# Altium schematic sheet usb_io_v3_sch.SchDoc
size A
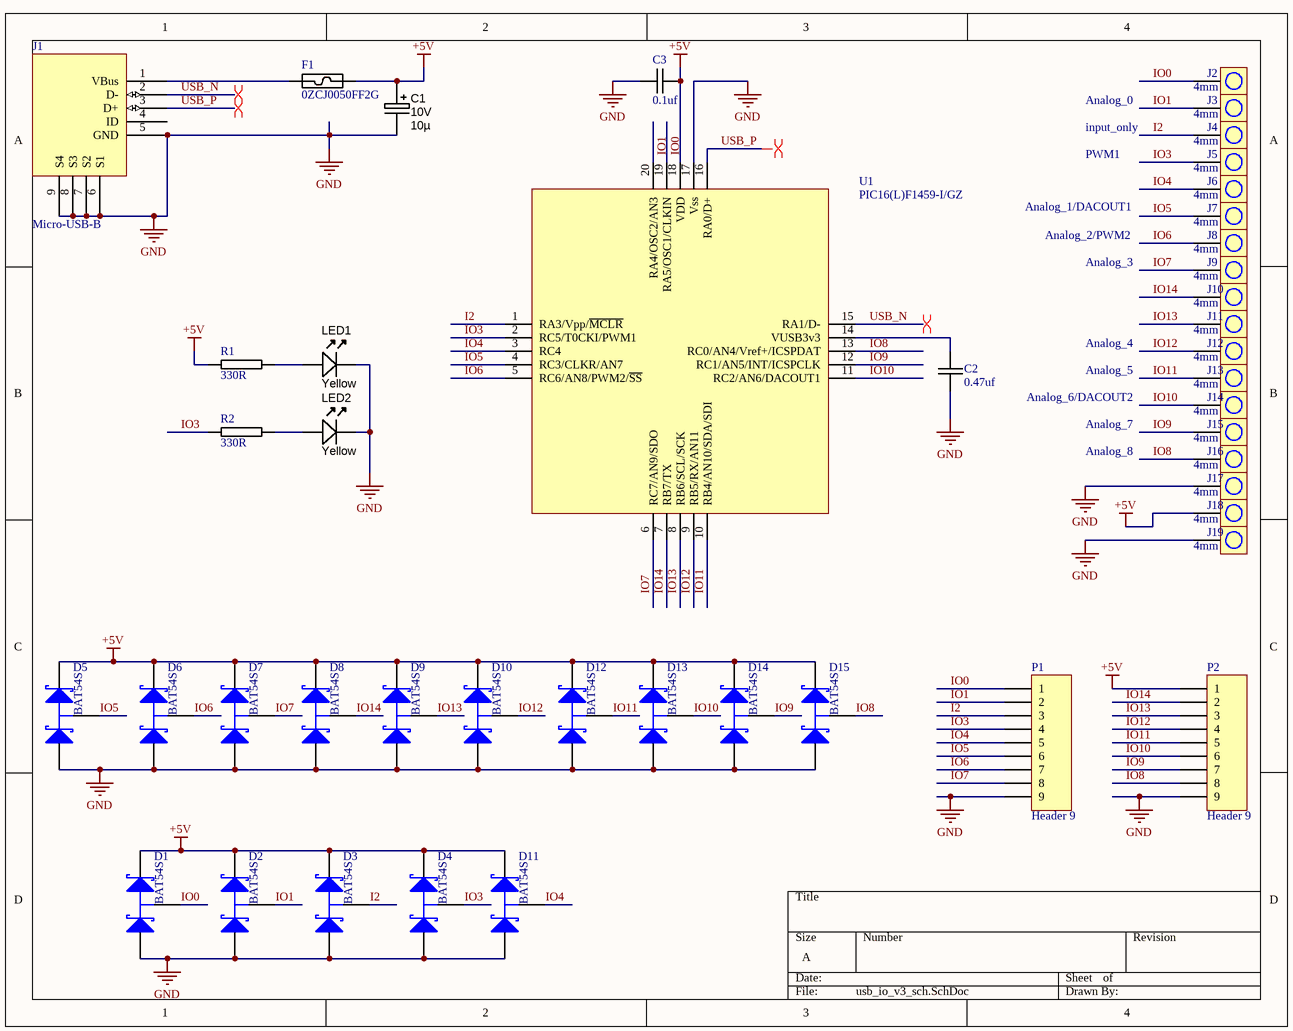
[diagram p0: usb_io_v3_sch.SchDoc]

## Parts
C1  Ratings: 10V  [CAPMP3528X210N]  (hidden comment: 10µ)
C2  0.47uf  [0603C-GENERIC]
C3  0.1uf  [0603C-GENERIC]
D1  BAT54S  [SOT23_N]
D2  BAT54S  [SOT23_N]
D3  BAT54S  [SOT23_N]
D4  BAT54S  [SOT23_N]
D5  BAT54S  [SOT23_N]
D6  BAT54S  [SOT23_N]
D7  BAT54S  [SOT23_N]
D8  BAT54S  [SOT23_N]
D9  BAT54S  [SOT23_N]
D10  BAT54S  [SOT23_N]
D11  BAT54S  [SOT23_N]
D12  BAT54S  [SOT23_N]
D13  BAT54S  [SOT23_N]
D14  BAT54S  [SOT23_N]
D15  BAT54S  [SOT23_N]
F1  0ZCJ0050FF2G  [RESC3216N]
J1  Micro-USB-B  [10118193-0001lfc]
J2  4mm  [header_4mm_drill]
J3  4mm  [header_4mm_drill]
J4  4mm  [header_4mm_drill]
J5  4mm  [header_4mm_drill]
J6  4mm  [header_4mm_drill]
J7  4mm  [header_4mm_drill]
J8  4mm  [header_4mm_drill]
J9  4mm  [header_4mm_drill]
J10  4mm  [header_4mm_drill]
J11  4mm  [header_4mm_drill]
J12  4mm  [header_4mm_drill]
J13  4mm  [header_4mm_drill]
J14  4mm  [header_4mm_drill]
J15  4mm  [header_4mm_drill]
J16  4mm  [header_4mm_drill]
J17  4mm  [header_4mm_drill]
J18  4mm  [header_4mm_drill]
J19  4mm  [header_4mm_drill]
LED1  Yellow  [LED-0603-YELLOW]
LED2  Yellow  [LED-0603-YELLOW]
P1  Header 9  [HDR1X9]
P2  Header 9  [HDR1X9]
R1  330R  [0603R-2K2]
R2  330R  [0603R-2K2]
U1  PIC16(L)F1459-I/GZ  [UQFN20_4x4]

## Nets
+5V: C1.1 C3.2 D1.2(K) D2.2(K) D3.2(K) D4.2(K) D5.2(K) D6.2(K) D7.2(K) D8.2(K) D9.2(K) D10.2(K) D11.2(K) D12.2(K) D13.2(K) D14.2(K) D15.2(K) F1.2 J18.1 P2.1 R1.2 U1.18(VDD)
GND: C1.2 C2.1 C3.1 D1.1(A) D2.1(A) D3.1(A) D4.1(A) D5.1(A) D6.1(A) D7.1(A) D8.1(A) D9.1(A) D10.1(A) D11.1(A) D12.1(A) D13.1(A) D14.1(A) D15.1(A) J1.5(GND) J1.6(S1) J1.7(S2) J1.8(S3) J1.9(S4) J17.1 J19.1 LED1.K LED2.K P1.9 P2.9 U1.17(Vss)
I2: D3.3(C) J4.1 P1.3 U1.1(RA3/Vpp/~{MCLR})
IO0: D1.3(C) J2.1 P1.1 U1.19(RA5/OSC1/CLKIN)
IO1: D2.3(C) J3.1 P1.2 U1.20(RA4/OSC2/AN3)
IO3: D4.3(C) J5.1 P1.4 R2.2 U1.2(RC5/T0CKI/PWM1)
IO4: D11.3(C) J6.1 P1.5 U1.3(RC4)
IO5: D5.3(C) J7.1 P1.6 U1.4(RC3/CLKR/AN7)
IO6: D6.3(C) J8.1 P1.7 U1.5(RC6/AN8/PWM2/~{SS})
IO7: D7.3(C) J9.1 P1.8 U1.6(RC7/AN9/SDO)
IO8: D15.3(C) J16.1 P2.8 U1.13(RC0/AN4/Vref+/ICSPDAT)
IO9: D14.3(C) J15.1 P2.7 U1.12(RC1/AN5/INT/ICSPCLK)
IO10: D13.3(C) J14.1 P2.6 U1.11(RC2/AN6/DACOUT1)
IO11: D12.3(C) J13.1 P2.5 U1.10(RB4/AN10/SDA/SDI)
IO12: D10.3(C) J12.1 P2.4 U1.9(RB5/RX/AN11)
IO13: D9.3(C) J11.1 P2.3 U1.8(RB6/SCL/SCK)
IO14: D8.3(C) J10.1 P2.2 U1.7(RB7/TX)
USB_N: J1.2(D-) U1.15(RA1/D-)
USB_P: J1.3(D+) U1.16(RA0/D+)
NetC2_2: C2.2 U1.14(VUSB3v3)
NetF1_1: F1.1 J1.1(VBus)
NetLED1_A: LED1.A R1.1
NetLED2_A: LED2.A R2.1

Not connected (* = marked no-connect by the designer): J1 4(ID)

## Layout directives
differential pair: USB_N, USB_P

## Notes on the sheet
- Analog_0
- input_only
- PWM1
- Analog_1/DACOUT1
- Analog_2/PWM2
- Analog_3
- Analog_4
- Analog_5
- Analog_6/DACOUT2
- Analog_7
- Analog_8

## Library data of the parts
C1 = CAPT_47u_1210_6V3: Capacitor SMD Tantalum 47uF 20% 6.3V 1210; Manufacturer 1: AVX Corporation; Manufacturer Part Number 1: TCJB476M006R0070; Manufacturer Size Code: B; Voltage - Rated: 6V3; ESR (Equivalent Series Resistance): 70.0 mOhm; Type: Molded; Package / Case: 1210 (3528 Metric); Tolerance: ±20%; Material: Tantalum; Supplier 1: Digi-Key; Supplier Part Number 1: 478-3139-1-ND; Operating Temperature: -55°C ~ 125°C; Size / Dimension: 0.138" L x 0.110" W (3.50mm x 2.80mm); Height - Seated (Max): 0.083" (2.10mm); ComponentLink1URL: http://www.avx.com/docs/Catalogs/tcj.pdf; ComponentLink1Description: http://www.avx.com/docs/Catalogs/tcj.pdf; Value: 10µ
C2 C3 = 0603C-10UF-6V3-X5R-MUR: CAPACITOR 0603 CERAMIC; Manufacturer: Murata Electronics North America; Manufacturer Part Number: GRM188R60J106ME47D; Reel: C24; Supplier 1: Digi-Key; Supplier Part Number 1: 490-3896-2-ND
D1-D15 = BAT54S: Schottky Barrier Double Diode; Published: 17-Sep-2003; LatestRevisionDate: 12-Dec-2006; LatestRevisionNote: IPC-7351 Footprint Added.; DatasheetVersion: 4-Mar-2002; PackageVersion: May-1999; PackageReference: SOT23; Publisher: Altium Limited; PackageDescription: 3-Pin SOT-23 Package 0.95 mm Pitch, 2.3 mm Lead Span; ComponentLink1Description: Manufacturer Link; ComponentLink1URL: http://www.semiconductors.philips.com/; ComponentLink2Description: Datasheet; ComponentLink2URL: http://www.semiconductors.philips.com/acrobat/datasheets/BAT54_SERIES_4.pdf
F1 = FUSE-GENERIC: GENERIC FUSE
J2-J19 = Banana_4mm
LED1 LED2 = LED_SMD_Yellow_0603_150mcd: LED 0603 SMD Yellow 590nm 150mcd 20mA; Manufacturer 1: Kingbright Corp; Manufacturer Part Number 1: APT1608SYCK; Material: AlGaInP on GaAs; Ratings: 150 mcd; 590 nm; Voltage - Forward (Vf) Typ: 2V; Voltage - Forward (Vf) @ 10mA: 1.95V; Package / Case: 0603 (1608 metric); Supplier 1: Digi-Key; Supplier Part Number 1: 754-1124-1-ND
P1 P2 = Header 9: Header, 9-Pin; LatestRevisionDate: 17-Jul-2002; LatestRevisionNote: Re-released for DXP Platform.; Publisher: Altium Limited
R1 R2 = 0603R-2K2: GENERIC RESISTOR 0603; Manufacturer Part Number: RMC 1/16 2.2K 1% R; Manufacturer: Stackpole Electronics Inc; REEL: R88; Supplier 1: Digi-Key; Supplier Part Number 1: RMCF0603FT2K20TR-ND